# Altium project PlatformMisc.PrjPCB
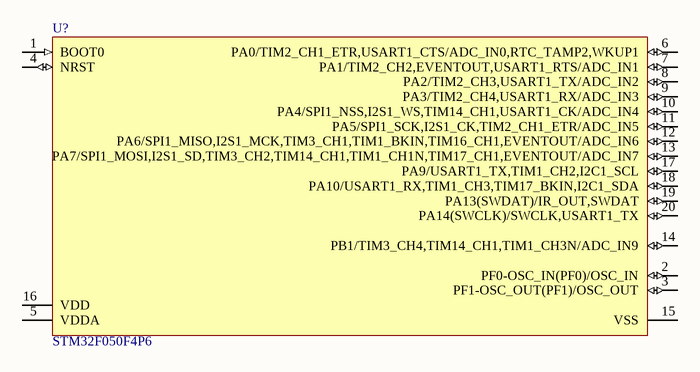
[diagram p0: ExpandBoard-050.SchDoc]
2 sheets, 30 parts. Net scope: global (net labels, ports and power ports of the same name join across sheets).
Board file: ExpandBoard-103-003.PcbDoc
Sheets:
  ExpandBoard-050.SchDoc
  ExpandBoard-103-003.SchDoc

## Sheet ExpandBoard-050.SchDoc
size A4

### Parts
U?  STM32F050F4P6  [STM-TSSOP20_N]

### Nets

Not connected (* = marked no-connect by the designer): U? 1(BOOT0) 2(PF0-OSC_IN(PF0)/OSC_IN) 3(PF1-OSC_OUT(PF1)/OSC_OUT) 4(NRST) 5(VDDA) 6(PA0/TIM2_CH1_ETR,USART1_CTS/ADC_IN0,RTC_TAMP2,WKUP1) 7(PA1/TIM2_CH2,EVENTOUT,USART1_RTS/ADC_IN1) 8(PA2/TIM2_CH3,USART1_TX/ADC_IN2) 9(PA3/TIM2_CH4,USART1_RX/ADC_IN3) 10(PA4/SPI1_NSS,I2S1_WS,TIM14_CH1,USART1_CK/ADC_IN4) 11(PA5/SPI1_SCK,I2S1_CK,TIM2_CH1_ETR/ADC_IN5) 12(PA6/SPI1_MISO,I2S1_MCK,TIM3_CH1,TIM1_BKIN,TIM16_CH1,EVENTOUT/ADC_IN6) 13(PA7/SPI1_MOSI,I2S1_SD,TIM3_CH2,TIM14_CH1,TIM1_CH1N,TIM17_CH1,EVENTOUT/ADC_IN7) 14(PB1/TIM3_CH4,TIM14_CH1,TIM1_CH3N/ADC_IN9) 15(VSS) 16(VDD) 17(PA9/USART1_TX,TIM1_CH2,I2C1_SCL) 18(PA10/USART1_RX,TIM1_CH3,TIM17_BKIN,I2C1_SDA) 19(PA13(SWDAT)/IR_OUT,SWDAT) 20(PA14(SWCLK)/SWCLK,USART1_TX)

### Library data of the parts
U? = STM32F050F4P6: ARM Cortex-M0 32-bit MCU, 16 KB Flash, 4 KB Internal RAM, 15 I/Os, 20-pin TSSOP, -40 to 85 degC, Tube; FLASH Size (Prog) (kB): 16; I/Os (High Current): 15; Internal RAM Size (kB): 4; Operating Frequency(F) (Processor speed) (MHz): 48; Supply Voltage(Vcc) min (V): 2; DatasheetVersion: Rev. 1; PackageVersion: Rev. 1, 11/2012; PackageReference: TSSOP20; PackageDescription: 20-Pin Thin Shrink Small Outline Package, 6.5 x 4.4 mm Body, 0.65 mm Pitch; Core: ARM Cortex-M0; Packing: Tube; Mounting Technology: Surface Mount; PartNumber: STM32F050F4P6; ComponentLink1Description: Manufacturer URL; ComponentLink1URL: http://www.st.com/web/en/home.html; ComponentLink2Description: Datasheet; ComponentLink2URL: http://www.st.com/st-web-ui/static/active/en/resource/technical/document/datasheet/DM00065136.pdf; ComponentLink3Description: Package Specification; ComponentLink3URL: http://www.st.com/st-web-ui/static/active/en/resource/technical/document/datasheet/DM00065136.pdf

## Sheet ExpandBoard-103-003.SchDoc
size A4
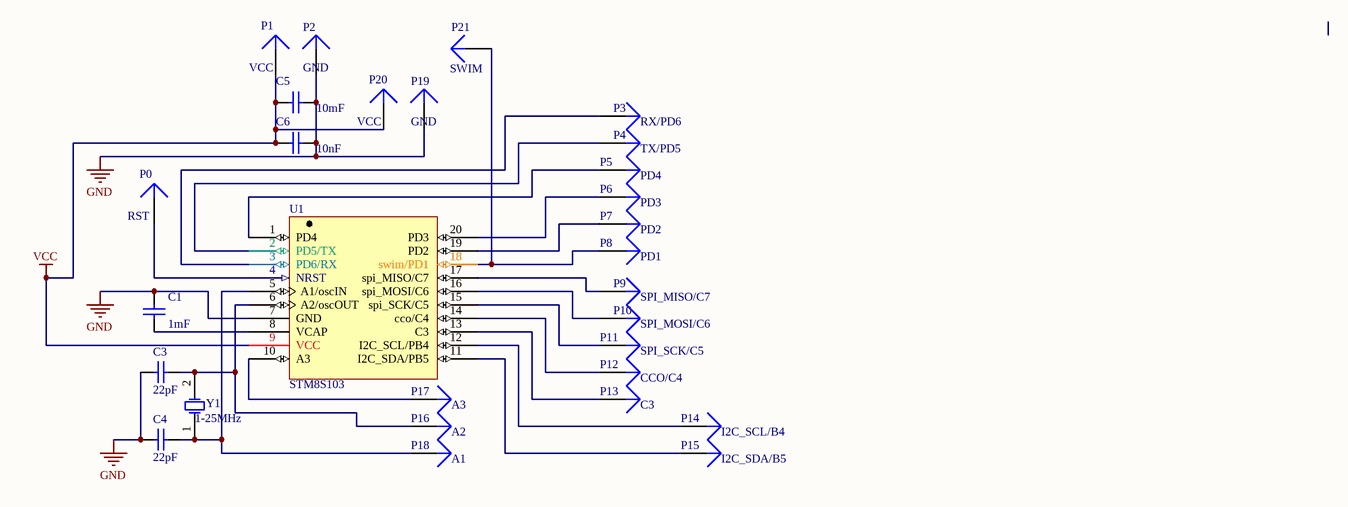
[diagram p1: ExpandBoard-103-003.SchDoc]

### Parts
C1  1mF  [CAPC0805(2012)75_L]
C3  22pF  [CAPC0805(2012)75_N]
C4  22pF  [CAPC0805(2012)75_N]
C5  10mF  [CAPC0805(2012)75_L]
C6  10nF  [CAPC0805(2012)75_L]
P0  RST  [PIN1]
P1  VCC  [PIN1]
P2  GND  [PIN1]
P3  RX/PD6  [PIN1]
P4  TX/PD5  [PIN1]
P5  PD4  [PIN1]
P6  PD3  [PIN1]
P7  PD2  [PIN1]
P8  PD1  [PIN1]
P9  SPI_MISO/C7  [PIN1]
P10  SPI_MOSI/C6  [PIN1]
P11  SPI_SCK/C5  [PIN1]
P12  CCO/C4  [PIN1]
P13  C3  [PIN1]
P14  I2C_SCL/B4  [PIN1]
P15  I2C_SDA/B5  [PIN1]
P16  A2  [PIN1]
P17  A3  [PIN1]
P18  A1  [PIN1]
P19  GND  [PIN1]
P20  VCC  [PIN1]
P21  SWIM  [PIN1]
U1  STM8S103  [TSSOP20]
Y1  1-25MHz  [3.2X1.6X1.1]

### Nets
GND: C1.2 C3.2 C4.2 C5.1 C6.1 P2.1 P19.1 U1.7(GND)
VCC: C5.2 C6.2 P1.1 P20.1 U1.9(VCC)
NetC1_1: C1.1 U1.8(VCAP)
NetC3_1: C3.1 P16.1 U1.6(A2/oscOUT) Y1.2(OSC2)
NetC4_1: C4.1 P18.1 U1.5(A1/oscIN) Y1.1(OSC1)
NetP0_1: P0.1 U1.4(NRST)
NetP3_1: P3.1 U1.3(PD6/RX)
NetP4_1: P4.1 U1.2(PD5/TX)
NetP5_1: P5.1 U1.1(PD4)
NetP6_1: P6.1 U1.20(PD3)
NetP7_1: P7.1 U1.19(PD2)
NetP8_1: P8.1 P21.1 U1.18(swim/PD1)
NetP9_1: P9.1 U1.17(spi_MISO/C7)
NetP10_1: P10.1 U1.16(spi_MOSI/C6)
NetP11_1: P11.1 U1.15(spi_SCK/C5)
NetP12_1: P12.1 U1.14(cco/C4)
NetP13_1: P13.1 U1.13(C3)
NetP14_1: P14.1 U1.12(I2C_SCL/PB4)
NetP15_1: P15.1 U1.11(I2C_SDA/PB5)
NetP17_1: P17.1 U1.10(A3)

### Library data of the parts
C1 C3-C6 = CAP
P0-P21 = Plug: LatestRevisionDate: 17-Jul-2002; LatestRevisionNote: Re-released for DXP Platform.; Publisher: Altium Limited
Y1 = XTAL: Crystal Oscillator; Published: 8-Jun-2000; LatestRevisionDate: 17-Jul-2002; LatestRevisionNote: Re-released for DXP Platform.; PackageReference: R38; Publisher: Altium Limited; PackageDescription: Crystal, Thru-Hole; 2 Leads; Body 3.1 x 8.2 mm (Dia.xH)